# Altium schematic sheet top_pi-dock.SchDoc
size Letter
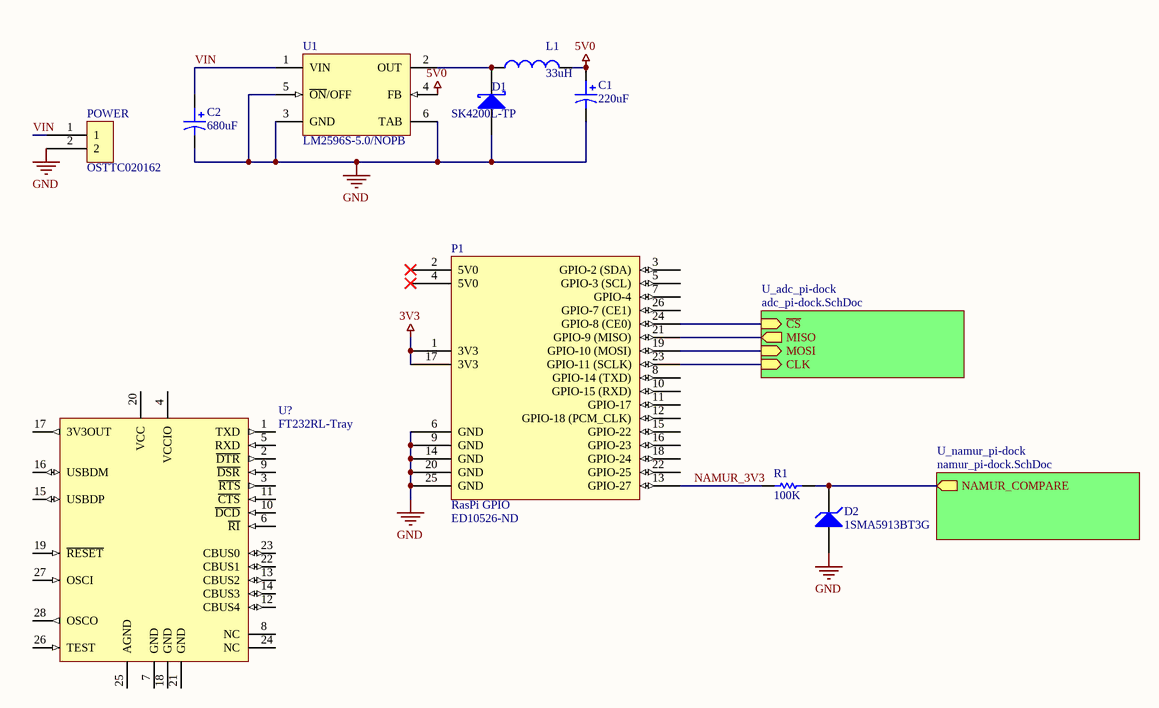
[diagram p0: top_pi-dock.SchDoc]

## Parts
C1  220uF  [CAPMP7343X31N]
C2  680uF  [Panasonic FM Series, Type A]
D1  SK4200L-TP  [DIOM6959X26N [DO-214AB]]
D2  1SMA5913BT3G  [DIOM6959X26N [DO-214AB]]
L1  33uH  [CDRH127]
P1  RasPi GPIO  Supplier Part Number 1: ED10526-ND  [HDR2X13]
POWER  OSTTC020162  [DIP2_5MM_SCREWTERM]
R1  100K  [RES_8085]
U1  LM2596S-5.0/NOPB  [TS5B_L]
U?  FT232RL-Tray  [SSOP-28_L]

## Sub-sheets
U_adc_pi-dock = adc_pi-dock.SchDoc: ~{CS} (in), MOSI (in), CLK (in), MISO (out)
U_namur_pi-dock = namur_pi-dock.SchDoc: NAMUR_COMPARE (out)

## Nets
3V3: P1.1(3V3) P1.17(3V3)
5V0: C1.1 L1.2 U1.4(FB)
GND: C1.2 C2.2 D1.2(A) D2.2(A) P1.6(GND) P1.9(GND) P1.14(GND) P1.20(GND) P1.25(GND) POWER.2 U1.3(GND) U1.5(~{ON}/OFF) U1.6(TAB)
NAMUR_3V3: P1.13(GPIO-27) R1.2
VIN: C2.1 POWER.1 U1.1(VIN)
NetD1_1: D1.1(K) L1.1 U1.2(OUT)
NetD2_1: D2.1(K) R1.1 ; sheet U_namur_pi-dock/NAMUR_COMPARE
NetP1_19: P1.19(GPIO-10_(MOSI)) ; sheet U_adc_pi-dock/MOSI
NetP1_21: P1.21(GPIO-9_(MISO)) ; sheet U_adc_pi-dock/MISO
NetP1_23: P1.23(GPIO-11_(SCLK)) ; sheet U_adc_pi-dock/CLK
NetP1_24: P1.24(GPIO-8_(CE0)) ; sheet U_adc_pi-dock/~{CS}

Not connected (* = marked no-connect by the designer): P1 2(5V0)* 3(GPIO-2_(SDA)) 4(5V0)* 5(GPIO-3_(SCL)) 7(GPIO-4) 8(GPIO-14_(TXD)) 10(GPIO-15_(RXD)) 11(GPIO-17) 12(GPIO-18_(PCM_CLK)) 15(GPIO-22) 16(GPIO-23) 18(GPIO-24) 22(GPIO-25) 26(GPIO-7_(CE1)); U? 1(TXD) 2(~{DTR}) 3(~{RTS}) 4(VCCIO) 5(RXD) 6(~{RI}) 7(GND) 8(NC) 9(~{DSR}) 10(~{DCD}) 11(~{CTS}) 12(CBUS4) 13(CBUS2) 14(CBUS3) 15(USBDP) 16(USBDM) 17(3V3OUT) 18(GND) 19(~{RESET}) 20(VCC) 21(GND) 22(CBUS1) 23(CBUS0) 24(NC) 25(AGND) 26(TEST) 27(OSCI) 28(OSCO)

## Library data of the parts
C1 = T491D227K010AT: Kemet CAP TANT 220UF 10V 10% 2917; Value: 220uF; Supplier 1: Digi-Key; Supplier Part Number 1: 399-8379-1-ND; ComponentLink1Description: Datasheet; ComponentLink1URL: http://www.kemet.com/Lists/ProductCatalog/Attachments/254/KEM_T2005_T491.pdf
C2 = EEU-FM1E681: Panasonic CAP ALUM 680UF 25V 20% RADIAL; Value: 680uF; ComponentLink1Description: Datasheet; ComponentLink1URL: http://industrial.panasonic.com/www-data/pdf/ABA0000/ABA0000CE108.pdf; Supplier 1: Digi-Key; Supplier Part Number 1: P12390-ND
D1 = SK4200L-TP: MCC DIODE SCHOTTKY 200V 4A DO214AB; ComponentLink1Description: Datasheet; ComponentLink1URL: http://www.mccsemi.com/up_pdf/SK4200L(SMC).pdf; Supplier 1: Digi-Key; Supplier Part Number 1: SK4200L-TPMSCT-ND
D2 = 1SMA5913BT3G: DIODE ZENER 3.3V 1.5W SMA; ComponentLink1Description: Datasheet; ComponentLink1URL: http://www.onsemi.com/pub_link/Collateral/1SMA5913BT3-D.PDF; Supplier 1: Digi-Key; Supplier Part Number 1: 1SMA5913BT3GOSCT-ND
L1 = CDRH127NP-330MC: Sumida Fixed Inductors 33uH 3A; Value: 33uH; ComponentLink1Description: Datasheet; ComponentLink1URL: http://www.sumida.com/products/pdf/CDRH127,127LD.pdf
P1 = RasPi Header: Raspberry Pi GPIO Header, 13-Pin, Dual row; ComponentLink1Description: Raspberry Pi GPIO Pinout; ComponentLink1URL: http://www.hobbytronics.co.uk/image/data/tutorial/raspberry-pi/gpio-pinout-rev2.jpg; Supplier 1: Digi-Key
POWER = OSTTC020162: ON SHORE TERMINAL BLOCK 5MM VERT 2POS PCB; ComponentLink1URL: http://www.on-shore.com/sites/default/files/manuals/osttcxx0162.pdf; ComponentLink1Description: Datasheet; Supplier 1: Digi-Key; Supplier Part Number 1: ED2600-ND
R1 = CHIP-RES: SMD Chip Resistor; Value: 100K
U1 = CMP-0069-00269-2: SIMPLE SWITCHER® Power Converter 150 KHz 3A Step-Down Voltage Regulator, 5-pin TO-263, Pb-Free; Manufacturer: National Semiconductor; PackageTopMarking: NSUZXYTTE#*LM2596S*-5.0 P+; PowerWise: N; PinCount: 5; ComponentLink3Description: TS5B Package Page; ComponentLink1Description: LM2596 Datasheet; DatasheetVersion: May-2002; ComponentLink3URL: http://www.national.com/packaging/folders/ts5b.html; PackageReference: TS5B; RoHS: Y; ComponentLink2Description: LM2596 Web Page; ComponentLink2URL: http://www.national.com/pf/LM/LM2596.html; ComponentLink1URL: http://www.national.com/ds/LM/LM2596.pdf; CompType: Switcher; RevisionNote: Component URLs added; PackageVersion: revD, Apr-2005; Code_JEDEC: MO-169-AB; PackageDescription: TO-263, Molded, .400 x .390 x .180in, 5 Lead, .067in Pitch, Surface Mount
U? = CMP-0078-00027-1: USB UART Asynchronous Serial Data Transfer Chip, SSOP-28, Tray; DatasheetVersion: ver 2.07, Jul-2010; PackageVersion: 2010; PackageReference: SSOP-28; PackageDescription: 28-Pin Small Outline Package 0.65 mm Pitch